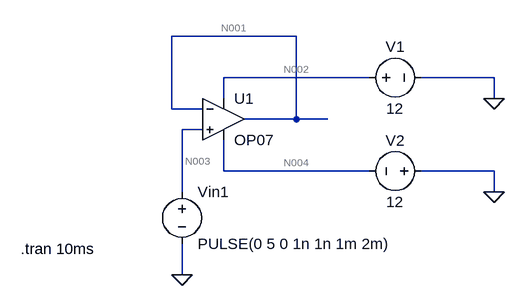
[diagram p0: schematic Exp1_Slew_rate.asc]
Exp1_Slew_rate.asc, the LTspice schematic file:
Version 4
SHEET 1 880 680
WIRE 112 -48 -80 -48
WIRE 224 16 0 16
WIRE 416 16 304 16
WIRE 0 48 0 16
WIRE 416 48 416 16
WIRE -80 64 -80 -48
WIRE -32 64 -80 64
WIRE 112 80 112 -48
WIRE 112 80 32 80
WIRE 160 80 112 80
WIRE -32 96 -64 96
WIRE 0 160 0 112
WIRE 224 160 0 160
WIRE 416 160 304 160
WIRE -64 192 -64 96
WIRE 416 192 416 160
WIRE -64 320 -64 272
FLAG 416 48 0
FLAG 416 192 0
FLAG -64 320 0
SYMBOL voltage -64 176 R0
WINDOW 123 0 0 Left 0
WINDOW 39 0 0 Left 0
SYMATTR InstName Vin1
SYMATTR Value PULSE(0 5 0 1n 1n 1m 2m)
SYMBOL voltage 208 16 R270
WINDOW 0 32 56 VTop 2
WINDOW 3 -32 56 VBottom 2
WINDOW 123 0 0 Left 0
WINDOW 39 0 0 Left 0
SYMATTR InstName V1
SYMATTR Value 12
SYMBOL voltage 320 160 R90
WINDOW 0 -32 56 VBottom 2
WINDOW 3 32 56 VTop 2
WINDOW 123 0 0 Left 0
WINDOW 39 0 0 Left 0
SYMATTR InstName V2
SYMATTR Value 12
SYMBOL OpAmps\\OP07 0 16 R0
SYMATTR InstName U1
TEXT -312 280 Left 2 !.tran 10ms

The netlist it stands for:
* Exp1_Slew_rate.asc
Vin1 N003 0 PULSE(0 5 0 1n 1n 1m 2m)
V1 N002 0 12
V2 0 N004 12
XU1 N003 N001 N002 N004 N001 LT1001  ; OP07, pins In+ In- V+ V- OUT
.tran 10ms
.lib LTC.lib
.backanno
.end

* Results of the author's LTspice run, read from the files saved beside the schematic
* Operating Point, zero values left out:
*   V(n002) = 12 V
*   V(n004) = -12 V
*   I(V1) = -2.25 mA
*   I(V2) = -2.25 mA
*   Ix(u1:3) = 2.25 mA
*   Ix(u1:4) = -2.25 mA
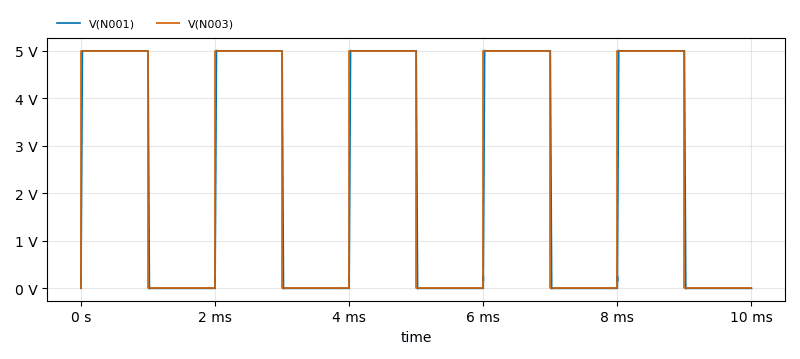
[diagram p1: Transient Analysis of Exp1_Slew_rate.asc, plotted from the saved traces]
* Transient Analysis, 1 run:
*   V(N001): min -9.676 mV, max 5.01 V, average 2.5 V, rms 3.524 V, last 0 V
*   V(N003): min 0 V, max 5 V, average 2.5 V, rms 3.536 V, last 0 V